# EAGLE design delay_stepper_interfrace_pcb (EAGLE 9.6.2)
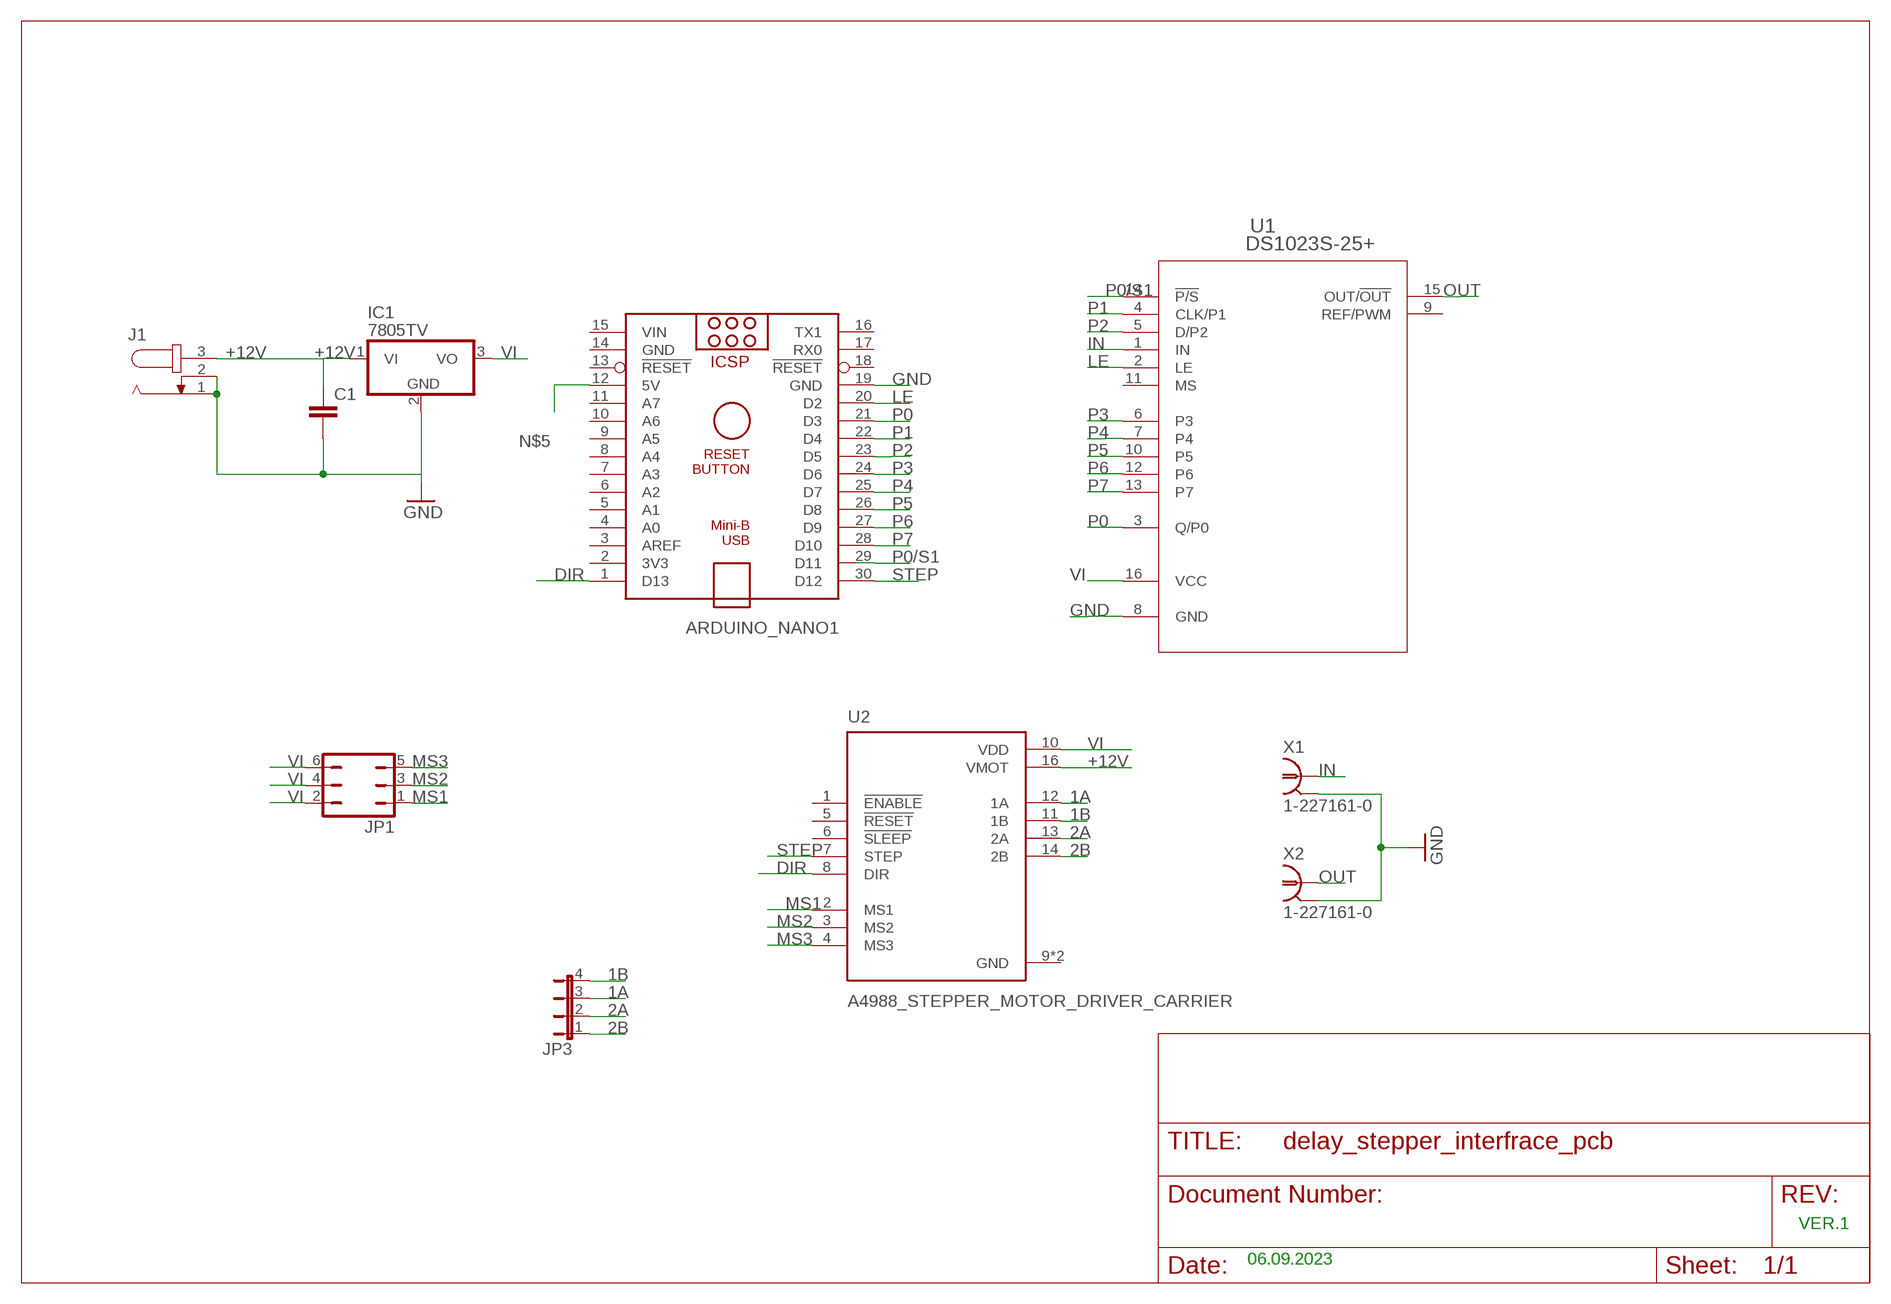
[diagram p0: schematic, sheet 1]

## Parts
ARDUINO_NANO1  ARDUINO_NANO  [ARDUINO_NANO]
C1  C2,5-3  [C2.5-3]
IC1  7805TV  [TO220V]
J1  JACK-PLUG0  [SPC4077]
JP1  JP3Q  [JP3Q]
JP3  JP4E  [JP4]
U1  DS1023S-25+  [21-0042_AA_ADI]
U2  A4988_STEPPER_MOTOR_DRIVER_CARRIER  [MODULE_A4988_STEPPER_MOTOR_DRIVER_CARRIER]
X1  1-227161-0  [AMP_227161]
X2  1-227161-0  [AMP_227161]

## Nets
1A: JP3.3 U2.12(1A)
1B: JP3.4 U2.11(1B)
2A: JP3.2 U2.13(2A)
2B: JP3.1 U2.14(2B)
+12V: C1.1 IC1.1(VI) J1.3 U2.16(VMOT)
DIR: ARDUINO_NANO1.1(D13) U2.8(DIR)
GND: ARDUINO_NANO1.19(GND) C1.2 IC1.2(GND) J1.1 J1.2 U1.8(GND) X1.2 X2.2
IN: U1.1(IN) X1.1
LE: ARDUINO_NANO1.20(D2) U1.2(LE)
MS1: JP1.1 U2.2(MS1)
MS2: JP1.3 U2.3(MS2)
MS3: JP1.5 U2.4(MS3)
N$5: ARDUINO_NANO1.12(5V)
OUT: U1.15(OUT/!OUT) X2.1
P0: ARDUINO_NANO1.21(D3) U1.3(Q/P0)
P0/S1: ARDUINO_NANO1.29(D11) U1.14(!P/S)
P1: ARDUINO_NANO1.22(D4) U1.4(CLK/P1)
P2: ARDUINO_NANO1.23(D5) U1.5(D/P2)
P3: ARDUINO_NANO1.24(D6) U1.6(P3)
P4: ARDUINO_NANO1.25(D7) U1.7(P4)
P5: ARDUINO_NANO1.26(D8) U1.10(P5)
P6: ARDUINO_NANO1.27(D9) U1.12(P6)
P7: ARDUINO_NANO1.28(D10) U1.13(P7)
STEP: ARDUINO_NANO1.30(D12) U2.7(STEP)
VI: IC1.3(VO) JP1.2 JP1.4 JP1.6 U1.16(VCC) U2.10(VDD)
Unconnected: ARDUINO_NANO1.2(3V3) ARDUINO_NANO1.3(AREF) ARDUINO_NANO1.4(A0) ARDUINO_NANO1.5(A1) ARDUINO_NANO1.6(A2) ARDUINO_NANO1.7(A3) ARDUINO_NANO1.8(A4) ARDUINO_NANO1.9(A5) ARDUINO_NANO1.10(A6) ARDUINO_NANO1.11(A7) ARDUINO_NANO1.13(!RESET) ARDUINO_NANO1.16(TX1) ARDUINO_NANO1.17(RX0) ARDUINO_NANO1.18(!RESET) U1.9(REF/PWM) U1.11(MS) U2.1(!ENABLE) U2.5(!RESET) U2.6(!SLEEP)

## Notes on the sheet
- VER.1
- 06.09.2023

## Power pins joined to a net without a drawn wire
GND: ARDUINO_NANO1.14(GND) U2.9(GND) U2.15(GND)
VIN: ARDUINO_NANO1.15(VIN)

## Library data of the parts
ARDUINO_NANO1 = ArduinoNanoV30:ARDUINO_NANO: Arduino Nano V3.0 Overview: The Arduino Nano is a small, complete, and breadboard-friendly board based on the ATmega328 (Arduino Nano 3.x) or ATmega168 (Arduino Nano 2.x). It has more or less the same functionality of the Arduino Duemilanove, but in a different package. It lacks only a DC power jack, and works with a Mini-B USB cable instead of a standard one. The Nano was designed and is being produced by Gravitech. Specifications: Microcontroller Atmel ATmega168 or ATmega328 Operating Voltage (logic level) 5 V Input Voltage (recommended) 7-12 V Input Voltage (limits) 6-20 V Digital I/O Pins 14 (of which 6 provide PWM output) Analog Input Pins 8 DC Current per I/O Pin 40 mA Flash Memory 16 KB (ATmega168) or 32 KB (ATmega328) of which 2 KB used by bootloader SRAM 1 KB (ATmega168) or 2 KB (ATmega328) EEPROM 512 bytes (ATmega168) or 1 KB (ATmega328) Clock Speed 16 MHz Dimensions 0.73" x 1.70" Length 45 mm Width 18 mm Weigth 5 g Power: The Arduino Nano can be powered via the Mini-B USB connection, 6-20V unregulated external power supply (pin 30), or 5V regulated external power supply (pin 27). The power source is automatically selected to the highest voltage source. Memory: The ATmega168 has 16 KB of flash memory for storing code (of which 2 KB is used for the bootloader); the ATmega328 has 32 KB, (also with 2 KB used for the bootloader). The ATmega168 has 1 KB of SRAM and 512 bytes of EEPROM (which can be read and written with the EEPROM library); the ATmega328 has 2 KB of SRAM and 1 KB of EEPROM. Input and Output: Each of the 14 digital pins on the Nano can be used as an input or output, using pinMode(), digitalWrite(), and digitalRead() functions. They operate at 5 volts. Each pin can provide or receive a maximum of 40 mA and has an internal pull-up resistor (disconnected by default) of 20-50 kOhms. In addition, some pins have specialized functions. Visit Arduino - ArduinoBoardNano <https://www.arduino.cc/en/Main/ArduinoBoardNano>
C1 = capacitor-wima:C: CAPACITOR naming: grid - package width
IC1 = linear:78*: Positive VOLTAGE REGULATOR Source: http://cache.national.com/ds/LM/LM78L05.pdf http://www.fairchildsemi.com/ds/LM/LM7805.pdf
J1 = con-jack:JACK-PLUG: DC POWER JACK Power Jack, DC, Right Angle, Through Hole, Rated 5A at 16VDC, PC Terminals Distributor: Farnell (www.Farnell.de) Drawing: 84N1161.pdf / 84N1162.pdf Manufacturer: SPC Technology (www.spctechnology.com) Type: SPC4077 / SPC 4078; OC_FARNELL: unknown; OC_NEWARK: unknown
JP1 = jumper:JP3Q: JUMPER
JP3 = jumper:JP4E: JUMPER
U1 = DS102325+:DS1023S-25+; COPYRIGHT: Copyright (C) 2023 Ultra Librarian. All rights reserved.; MANUFACTURER_PART_NUMBER: DS1023S-25+; MFR_NAME: Analog Devices Inc; TYPE: Clock, timing
U2 = A4988_STEPPER_MOTOR_DRIVER_CARRIER:A4988_STEPPER_MOTOR_DRIVER_CARRIER: Stepper motor controler; IC: A4988; 1A; Uin mot: 8÷35V Check availability <https://pricing.snapeda.com/parts/A4988%20STEPPER%20MOTOR%20DRIVER%20CARRIER/Pololu/view-part?ref=eda>; AVAILABILITY: Not in stock; CHECK_PRICES: https://www.snapeda.com/parts/A4988%20STEPPER%20MOTOR%20DRIVER%20CARRIER/Pololu/view-part/?ref=eda; DESCRIPTION: Stepper Motor Driver; MF: Pololu; MP: A4988 STEPPER MOTOR DRIVER CARRIER; PACKAGE: None; PRICE: None; SNAPEDA_LINK: https://www.snapeda.com/parts/A4988%20STEPPER%20MOTOR%20DRIVER%20CARRIER/Pololu/view-part/?ref=snap
X1 X2 = con-coax:?227161*: JACK, RIGHT ANGLE, 50 OHM, PCB, BNC Source: amp_227161.pdf; MF: TYCO ELECTRONICS; MPN: 1-227161; OC_FARNELL: unknown; OC_NEWARK: 33B3200

## Board
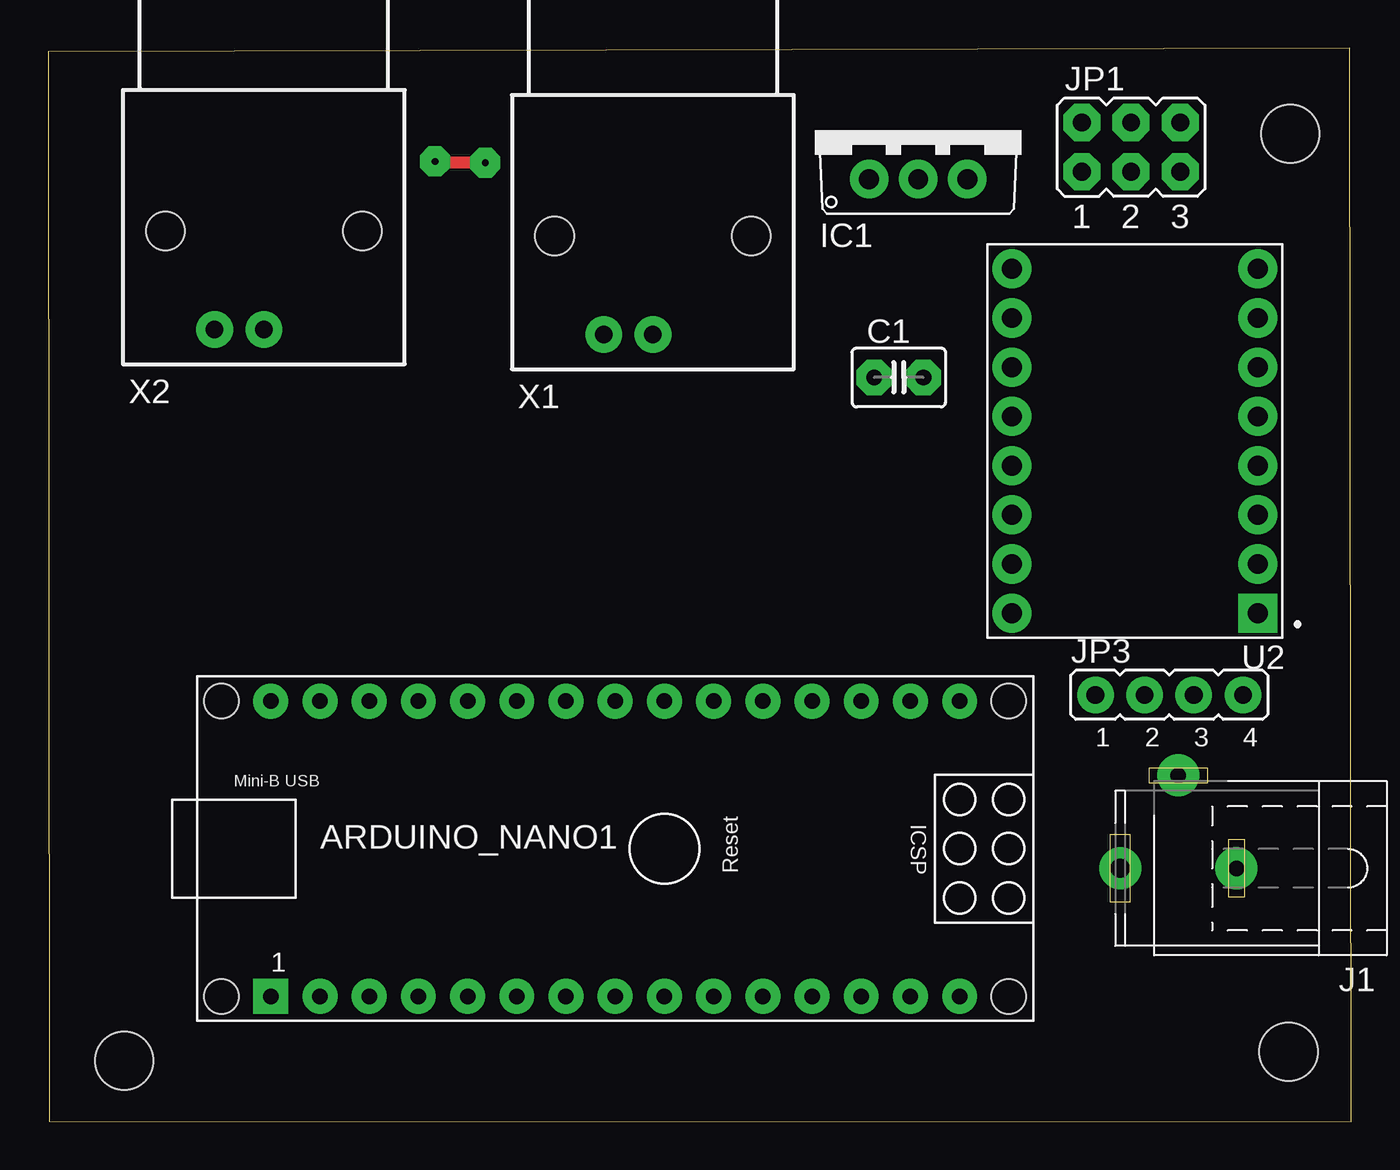
[diagram p1: board, top side]
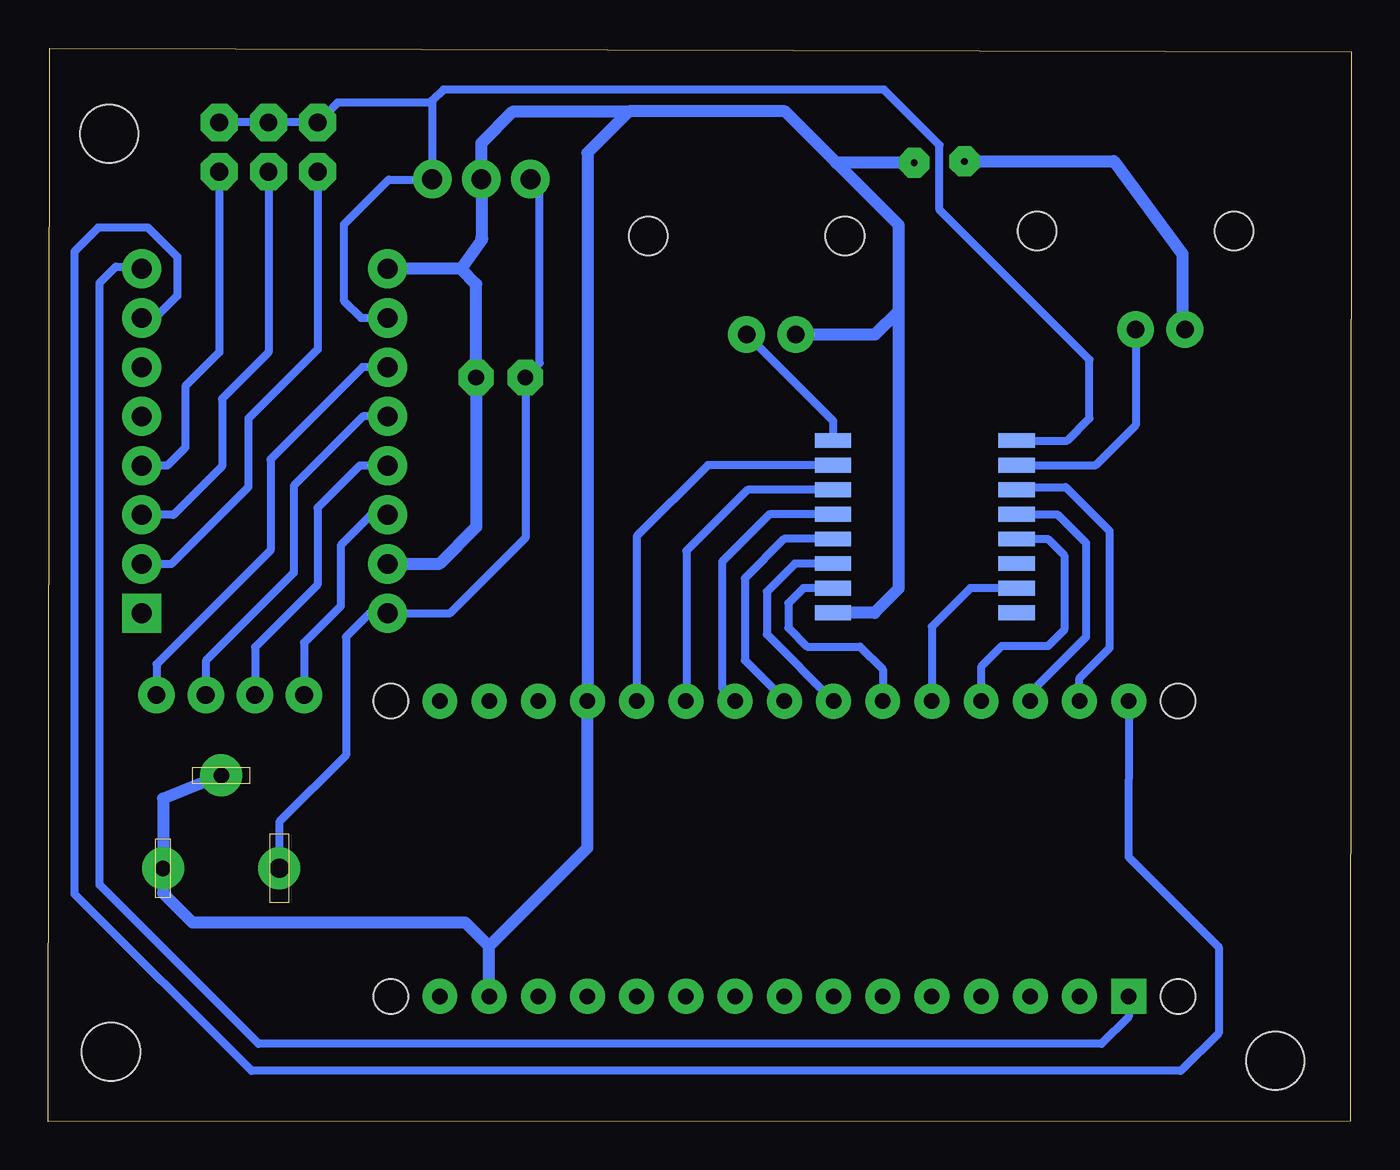
[diagram p2: board, bottom side, seen from below]

Size 67.25 x 55.38 mm. Coordinates in mm from the lower left corner, seen from the top.
Outline: 0.04,0.01 67.25,0 67.18,55.38 0,55.22 0.04,0.01
Copper layers (1*16): Top 0.035mm / dielectric 1.5mm / Bottom 0.035mm
Design rules "default *": minimum track width 6mil, minimum drill 2mm, track to track 0.3mm, track to pad 0.3mm, pad to pad 6mil, via to via 6mil, smd to smd 6mil, copper to edge 40mil, drill to drill 1mm, minimum pad ring 0.5mm, minimum via ring 0.6mm, stop-mask expansion 4mil, vias tented up to drill 0mil, thermal gap 10mil
Holes 3 mm at 3.91,3.13 64.02,3.6 64.11,50.98

### Footprints (pad centres in the part's own frame; a part is rotated, then mirrored left to right if it is on the bottom)
ARDUINO_NANO = drill 0.8 square: 1 -20.32,-7.62 | drill 0.8: 2 -17.78,-7.62; 3 -15.24,-7.62; 4 -12.7,-7.62; 5 -10.16,-7.62; 6 -7.62,-7.62; 7 -5.08,-7.62; 8 -2.54,-7.62; 9 0,-7.62; 10 2.54,-7.62; 11 5.08,-7.62; 12 7.62,-7.62; 13 10.16,-7.62; 14 12.7,-7.62; 15 15.24,-7.62; 16 15.24,7.62; 17 12.7,7.62; 18 10.16,7.62; 19 7.62,7.62; 20 5.08,7.62; 21 2.54,7.62; 22 0,7.62; 23 -2.54,7.62; 24 -5.08,7.62; 25 -7.62,7.62; 26 -10.16,7.62; 27 -12.7,7.62; 28 -15.24,7.62; 29 -17.78,7.62; 30 -20.32,7.62 | hole 1.778: -22.86,-7.62; -22.86,7.62; 17.78,7.62; 17.78,-7.62
C2.5-3 = drill 0.813 pad 1.6 octagon: 1 -1.27,0; 2 1.27,0
TO220V = drill 1.016 long: 1 -2.54,-2.54; 2 0,-2.54; 3 2.54,-2.54
SPC4077 = drill 0.8 pad 2.184 long: 1 -3,0; 2 0,-4.8 | drill 1 pad 2.184 long: 3 3,0
JP3Q = drill 0.914 octagon: 1 -2.54,-1.27; 2 -2.54,1.27; 3 0,-1.27; 4 0,1.27; 5 2.54,-1.27; 6 2.54,1.27
JP4 = drill 0.914 long: 1 -3.81,0; 2 -1.27,0; 3 1.27,0; 4 3.81,0
21-0042_AA_ADI = smd 1.88 x 0.762: 1 -4.737,4.445; 2 -4.737,3.175; 3 -4.737,1.905; 4 -4.737,0.635; 5 -4.737,-0.635; 6 -4.737,-1.905; 7 -4.737,-3.175; 8 -4.737,-4.445; 9 4.737,-4.445; 10 4.737,-3.175; 11 4.737,-1.905; 12 4.737,-0.635; 13 4.737,0.635; 14 4.737,1.905; 15 4.737,3.175; 16 4.737,4.445
MODULE_A4988_STEPPER_MOTOR_DRIVER_CARRIER = drill 1.02 square: 1 -6.35,8.89 | drill 1.02: 2 -6.35,6.35; 3 -6.35,3.81; 4 -6.35,1.27; 5 -6.35,-1.27; 6 -6.35,-3.81; 7 -6.35,-6.35; 8 -6.35,-8.89; 9 6.35,-8.89; 10 6.35,-6.35; 11 6.35,-3.81; 12 6.35,-1.27; 13 6.35,1.27; 14 6.35,3.81; 15 6.35,6.35; 16 6.35,8.89
AMP_227161 = drill 0.9 pad 1.27: 1 0,-5.08; 2 -2.54,-5.08 | hole 2: -5.08,0; 5.08,0

### Placement (x,y rotation side)
ARDUINO_NANO1  31.8,14.08 0 top
C1  43.9,38.4 0 top
IC1  44.9,51.17 0 top
J1  58.33,13.07 180 top
JP1  55.89,50.29 0 top
JP3  57.86,22.02 0 top
U1  22.01,30.7 0 bottom
U2  56.09,35.12 180 top
X1  31.21,45.7 0 top
X2  11.12,45.96 0 top

### Tracks (layer width: path | path; a pad name or v marks a point on that pad's centre or on a via)
1A
  Bottom 0.406: U2.12 51.01,36.39 54.59,32.81 54.59,28.32 59.13,23.78 JP3.3
1B
  Bottom 0.406: U2.11 51.03,38.93 55.79,34.17 55.79,29.48 61.67,23.6 JP3.4
2A
  Bottom 0.406: U2.13 51.18,33.85 53.36,31.67 53.36,27.71 56.59,24.48 JP3.2
2B
  Bottom 0.406: U2.14 50.58,31.31 52.16,29.73 52.16,26.6 54.05,24.71 JP3.1
+12V
  Bottom 0.406: IC1.1 41.89,48.16 41.89,39.14 C1.1 42.63,30.12 46.54,26.21 49.72,26.21 U2.16 50.67,26.23 51.89,25.01 51.89,18.91 55.33,15.47 J1.3
DIR
  Bottom 0.406: U2.8 62.55,44.12 63.77,44.12 64.61,43.28 64.61,12.22 56.4,4.01 12.89,4.01 11.48,5.42 ARDUINO_NANO1.1
GND  (via drill 0.35)
  Top 0.61: v22.55,49.48 v22.54,49.49 20.02,49.49 v19.96,49.55
  Bottom 0.61: ARDUINO_NANO1.14 44.5,9.04 | 44.5,9.04 39.42,14.12 ARDUINO_NANO1.19 39.42,49.99 37.28,52.13 | X2.2 8.7,41 8.7,44.76 12.25,49.56 v19.95,49.56 v19.96,49.55 | C1.2 | J1.2 61.33,16.67 J1.1 61.33,11.79 59.82,10.29 45.74,10.29 44.5,9.04 | 45.96,44.01 45.86,44.11 44.85,45.57 44.9,45.62 IC1.2 44.9,50.49 43.26,52.13 37.28,52.13 | 45.96,44.01 U2.9 | C1.2 45.17,43.22 45.96,44.01 | 23.35,41.85 23.35,27.51 24.61,26.26 U1.8 | 23.35,41.85 23.35,46.26 26.57,49.48 | X1.2 24.58,40.62 23.35,41.85 | v22.55,49.48 26.57,49.48 | 37.28,52.13 29.22,52.13 26.57,49.48 | C1.2 45.17,30.69 47.09,28.77 U2.15
IN
  Bottom 0.406: X1.1 26.75,36.16 U1.1
LE
  Bottom 0.406: U1.2 33.2,33.88 36.88,30.2 ARDUINO_NANO1.20
MS1
  Bottom 0.406: JP1.1 53.35,39.85 56.93,36.27 56.93,32.74 60.9,28.77 U2.2
MS2
  Bottom 0.406: JP1.3 55.89,39.7 58.29,37.3 58.29,33.81 60.79,31.31 U2.3
MS3
  Bottom 0.406: JP1.5 58.43,39.69 60.18,37.94 60.18,34.78 61.11,33.85 U2.4
N$1  (via drill 0.35 pad 1.5)
  other vias: 6.04,45.98
N$2  (via drill 0.35 pad 1.5)
  other vias: 16.19,45.98
N$3  (via drill 0.35 pad 1.5)
  other vias: 26.14,45.69
N$4  (via drill 0.35 pad 1.5)
  other vias: 36.29,45.71
OUT
  Bottom 0.406: U1.15 13.18,33.88 11.12,35.93 X2.1
P0
  Bottom 0.406: U1.3 31.16,32.6 34.31,29.45 34.31,21.73 ARDUINO_NANO1.21
P0/S1
  Bottom 0.406: U1.14 17.14,32.73 14.72,32.73 12.47,30.48 12.47,24.43 14.02,22.88 ARDUINO_NANO1.29
P1
  Bottom 0.406: U1.4 30.04,31.34 32.47,28.9 32.47,22.37 ARDUINO_NANO1.22
P2
  Bottom 0.406: ARDUINO_NANO1.23 29.26,21.76 31.3,23.8 31.3,28.03 29.27,30.07 U1.5 26.91,30.23
P3
  Bottom 0.406: U1.6 28.71,28.8 30.16,27.35 30.16,25.14 ARDUINO_NANO1.24
P4
  Bottom 0.406: U1.7 28.28,27.53 29.05,26.75 29.05,25.48 28.08,24.51 25.35,24.51 24.18,23.34 ARDUINO_NANO1.25
P5
  Bottom 0.406: 17.3,27.53 U1.10 19.66,27.53 21.64,25.54 ARDUINO_NANO1.26
P6
  Bottom 0.406: 16.68,30.07 U1.12 15.65,30.07 14.81,29.22 14.81,25.37 15.65,24.53 18.04,24.53 19.1,23.47 ARDUINO_NANO1.27
P7
  Bottom 0.406: U1.13 15.16,31.34 13.69,29.86 13.69,25 16.56,22.13 ARDUINO_NANO1.28
STEP
  Bottom 0.406: U2.7 61.74,41.47 60.6,42.61 60.6,44.63 62.1,46.13 64.68,46.13 65.91,44.9 65.91,11.75 56.77,2.61 8.79,2.61 6.83,4.57 6.83,9 11.49,13.66 ARDUINO_NANO1.30
VI
  Bottom 0.406: IC1.3 47.39,48.68 | U1.16 14.65,35.14 13.51,36.29 13.51,39.32 21.24,47.05 21.24,50.39 24.11,53.26 46.86,53.26 47.44,52.68 | 47.44,52.68 47.44,52.73 47.58,52.59 52.32,52.59 JP1.2 JP1.4 JP1.6 | 47.44,52.68 IC1.3 | IC1.3 47.46,48.61 49.68,48.61 52,46.29 52,42.36 51.11,41.47 U2.10